# EAGLE design cubey_v3 (EAGLE 9.6.2)
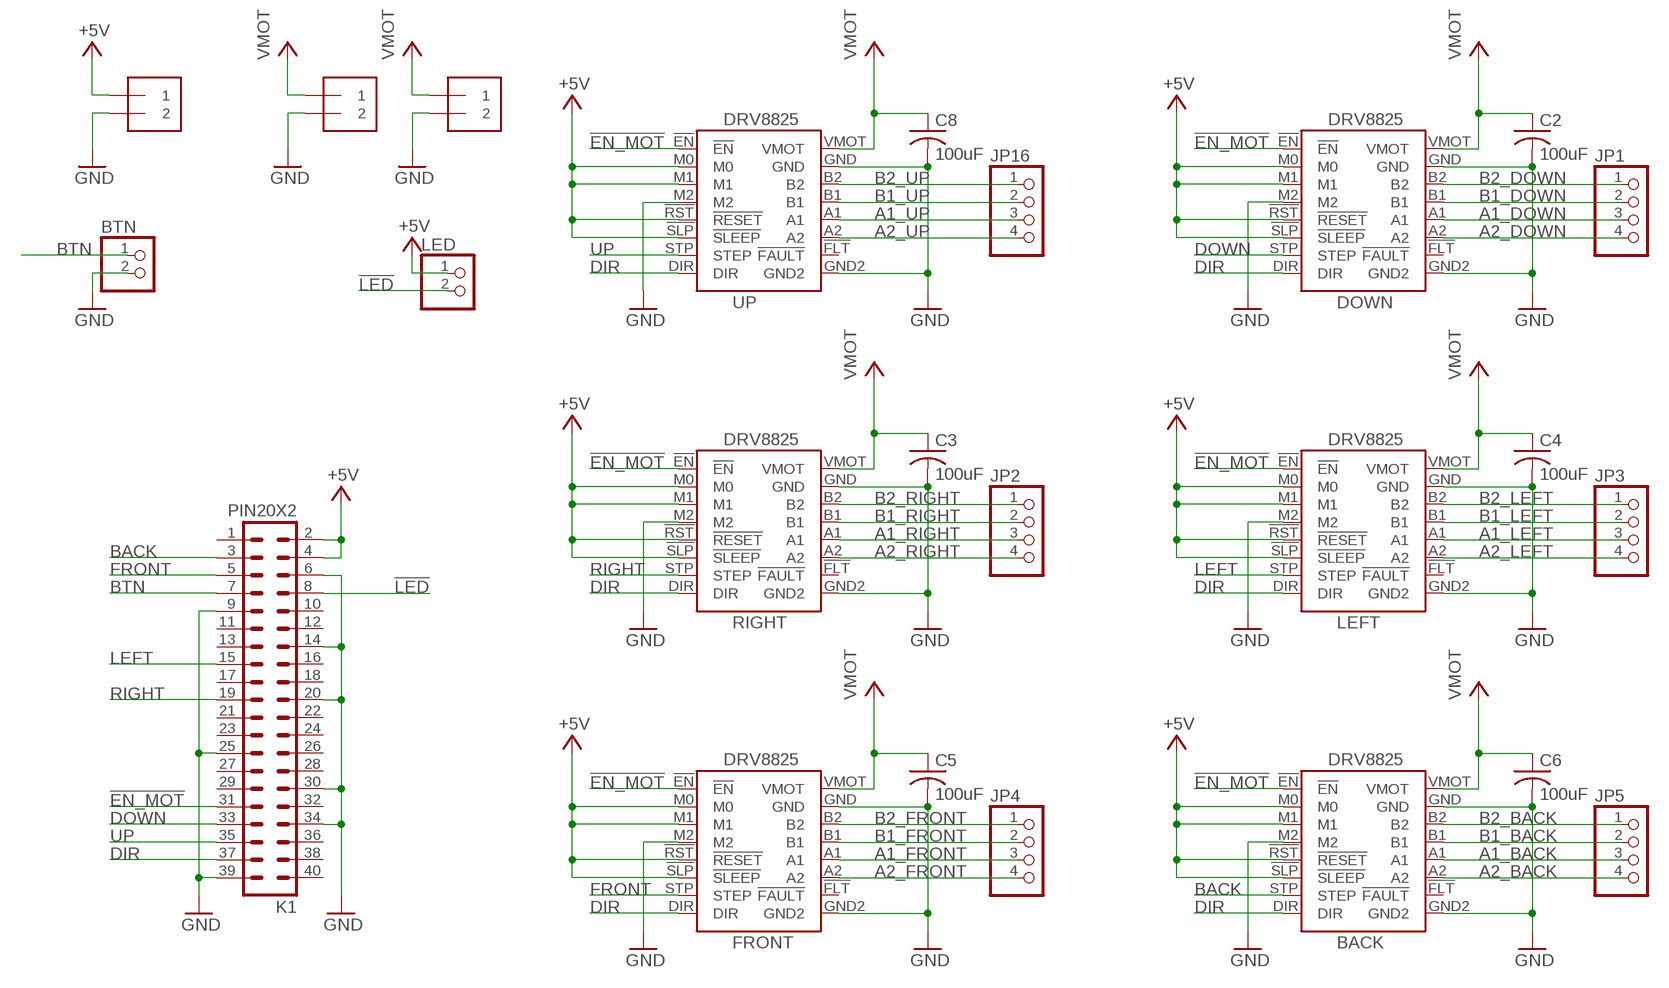
[diagram p0: schematic, sheet 1]

## Parts
5V_PWR  1X2-3.5MM  [1X2-3.5MM]
BACK  DRV_8825_SOCKET  [DRV_8825_DIP]
BTN  PINHD-1X2  [1X02]
C2  100uF  C-US025-025X050  [C025-025X050]
C3  100uF  C-US025-025X050  [C025-025X050]
C4  100uF  C-US025-025X050  [C025-025X050]
C5  100uF  C-US025-025X050  [C025-025X050]
C6  100uF  C-US025-025X050  [C025-025X050]
C8  100uF  C-US025-025X050  [C025-025X050]
DOWN  DRV_8825_SOCKET  [DRV_8825_DIP]
FRONT  DRV_8825_SOCKET  [DRV_8825_DIP]
JP1  PINHD-1X4  [1X04]
JP2  PINHD-1X4  [1X04]
JP3  PINHD-1X4  [1X04]
JP4  PINHD-1X4  [1X04]
JP5  PINHD-1X4  [1X04]
JP16  PINHD-1X4  [1X04]
K1  PIN20X2  [PIN_20X2]
LED  PINHD-1X2  [1X02]
LEFT  DRV_8825_SOCKET  [DRV_8825_DIP]
MOT_PWR  1X2-3.5MM  [1X2-3.5MM]
MOT_PWR1  1X2-3.5MM  [1X2-3.5MM]
RIGHT  DRV_8825_SOCKET  [DRV_8825_DIP]
UP  DRV_8825_SOCKET  [DRV_8825_DIP]

## Nets
!EN_MOT: BACK.!EN DOWN.!EN FRONT.!EN K1.31 LEFT.!EN RIGHT.!EN UP.!EN
!LED: K1.8 LED.2
+5V: 5V_PWR.1 BACK.!RST(!RESET) BACK.!SLP(!SLEEP) BACK.M0 BACK.M1 DOWN.!RST(!RESET) DOWN.!SLP(!SLEEP) DOWN.M0 DOWN.M1 FRONT.!RST(!RESET) FRONT.!SLP(!SLEEP) FRONT.M0 FRONT.M1 K1.2 K1.4 LED.1 LEFT.!RST(!RESET) LEFT.!SLP(!SLEEP) LEFT.M0 LEFT.M1 RIGHT.!RST(!RESET) RIGHT.!SLP(!SLEEP) RIGHT.M0 RIGHT.M1 UP.!RST(!RESET) UP.!SLP(!SLEEP) UP.M0 UP.M1
A1_BACK: BACK.A1 JP5.3
A1_DOWN: DOWN.A1 JP1.3
A1_FRONT: FRONT.A1 JP4.3
A1_LEFT: JP3.3 LEFT.A1
A1_RIGHT: JP2.3 RIGHT.A1
A1_UP: JP16.3 UP.A1
A2_BACK: BACK.A2 JP5.4
A2_DOWN: DOWN.A2 JP1.4
A2_FRONT: FRONT.A2 JP4.4
A2_LEFT: JP3.4 LEFT.A2
A2_RIGHT: JP2.4 RIGHT.A2
A2_UP: JP16.4 UP.A2
B1_BACK: BACK.B1 JP5.2
B1_DOWN: DOWN.B1 JP1.2
B1_FRONT: FRONT.B1 JP4.2
B1_LEFT: JP3.2 LEFT.B1
B1_RIGHT: JP2.2 RIGHT.B1
B1_UP: JP16.2 UP.B1
B2_BACK: BACK.B2 JP5.1
B2_DOWN: DOWN.B2 JP1.1
B2_FRONT: FRONT.B2 JP4.1
B2_LEFT: JP3.1 LEFT.B2
B2_RIGHT: JP2.1 RIGHT.B2
B2_UP: JP16.1 UP.B2
BACK: BACK.STP(STEP) K1.3
BTN: BTN.1 K1.7
DIR: BACK.DIR DOWN.DIR FRONT.DIR K1.37 LEFT.DIR RIGHT.DIR UP.DIR
DOWN: DOWN.STP(STEP) K1.33
FRONT: FRONT.STP(STEP) K1.5
GND: 5V_PWR.2 BACK.GND BACK.GND2 BACK.M2 BTN.2 C2.2 C3.2 C4.2 C5.2 C6.2 C8.2 DOWN.GND DOWN.GND2 DOWN.M2 FRONT.GND FRONT.GND2 FRONT.M2 K1.6 K1.9 K1.14 K1.20 K1.25 K1.30 K1.34 K1.39 LEFT.GND LEFT.GND2 LEFT.M2 MOT_PWR1.2 MOT_PWR.2 RIGHT.GND RIGHT.GND2 RIGHT.M2 UP.GND UP.GND2 UP.M2
LEFT: K1.15 LEFT.STP(STEP)
RIGHT: K1.19 RIGHT.STP(STEP)
UP: K1.35 UP.STP(STEP)
VCC: BACK.VMOT C2.1 C3.1 C4.1 C5.1 C6.1 C8.1 DOWN.VMOT FRONT.VMOT LEFT.VMOT MOT_PWR1.1 MOT_PWR.1 RIGHT.VMOT UP.VMOT ; supply symbol labelled VMOT
Unconnected: BACK.!FLT(!FAULT) DOWN.!FLT(!FAULT) FRONT.!FLT(!FAULT) K1.1 K1.10 K1.11 K1.12 K1.13 K1.16 K1.17 K1.18 K1.21 K1.22 K1.23 K1.24 K1.26 K1.27 K1.28 K1.29 K1.32 K1.36 K1.38 K1.40 LEFT.!FLT(!FAULT) RIGHT.!FLT(!FAULT) UP.!FLT(!FAULT)

## Library data of the parts
5V_PWR MOT_PWR MOT_PWR1 = adafruit:1X2: 3.5mm Terminal block http://www.ladyada.net/library/pcb/eaglelibrary.html
BACK DOWN FRONT LEFT RIGHT UP = cubey:DRV_8825_SOCKET: DIP socket for DRV_8825 module from Pololu
BTN LED = pinhead:PINHD-1X2: PIN HEADER
C2-C6 C8 = rcl:C-US: CAPACITOR, American symbol; SPICEPREFIX: C
JP1-JP5 JP16 = pinhead:PINHD-1X4: PIN HEADER
K1 = FLYFISH:PIN20X2

## Net classes
0 default: width 0.406 mm, clearance 0.203 mm

## Board
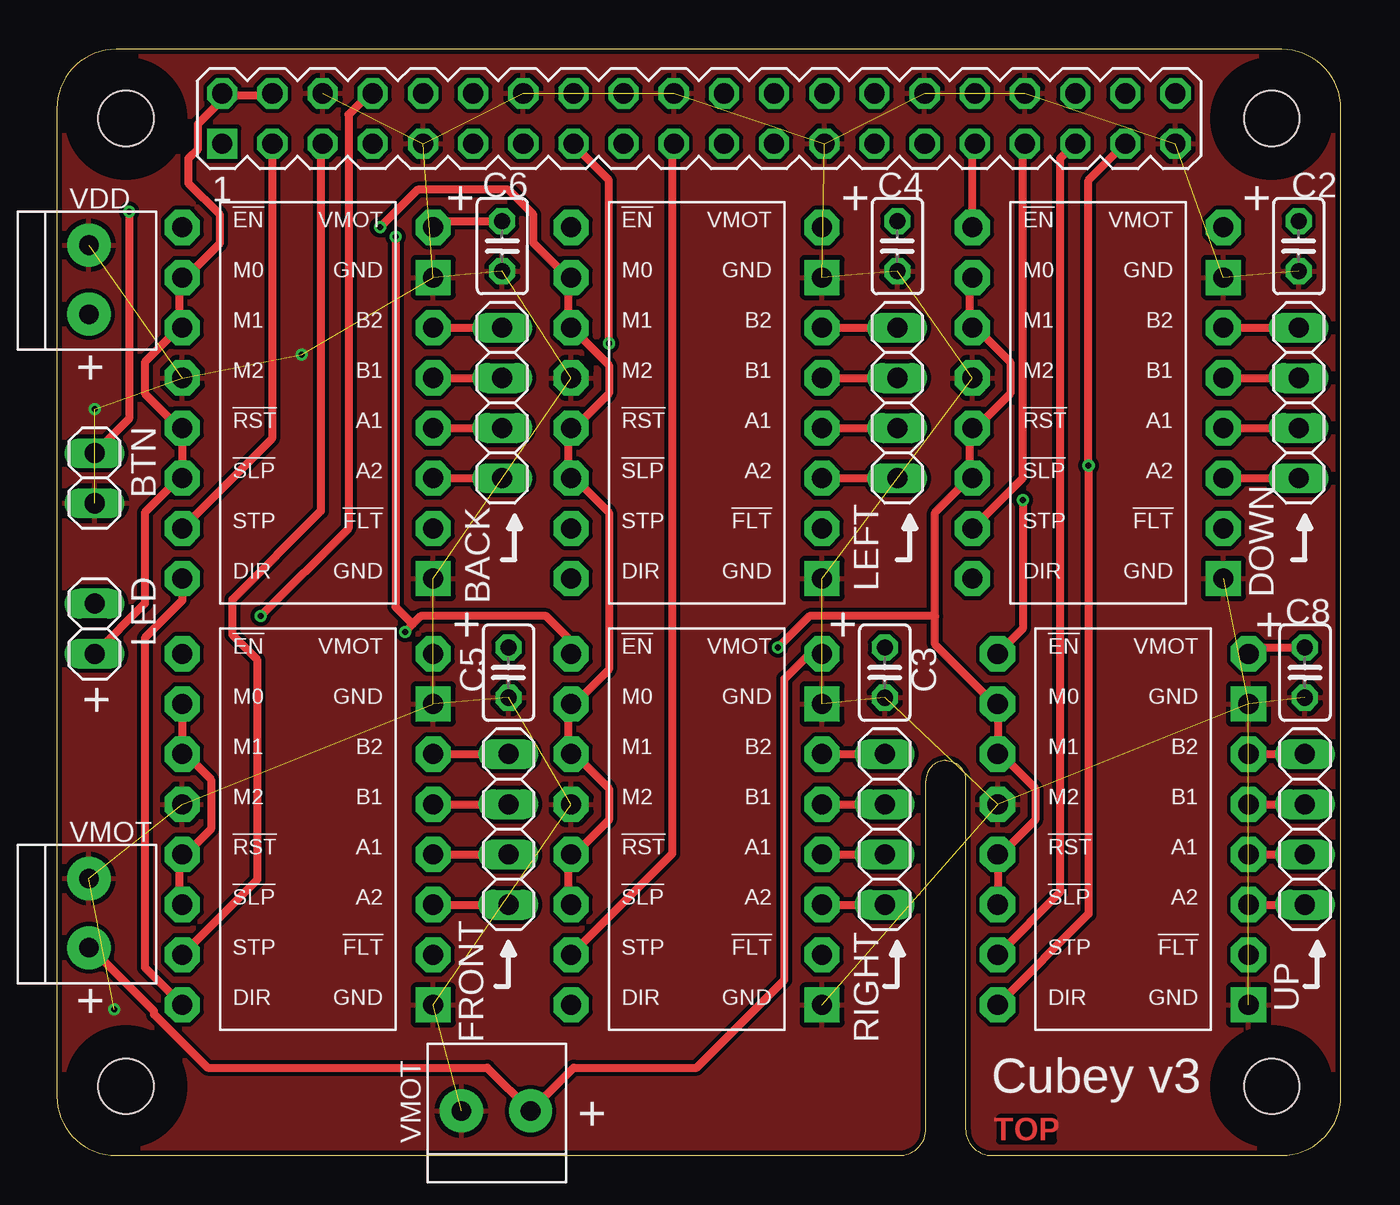
[diagram p1: board, top side]
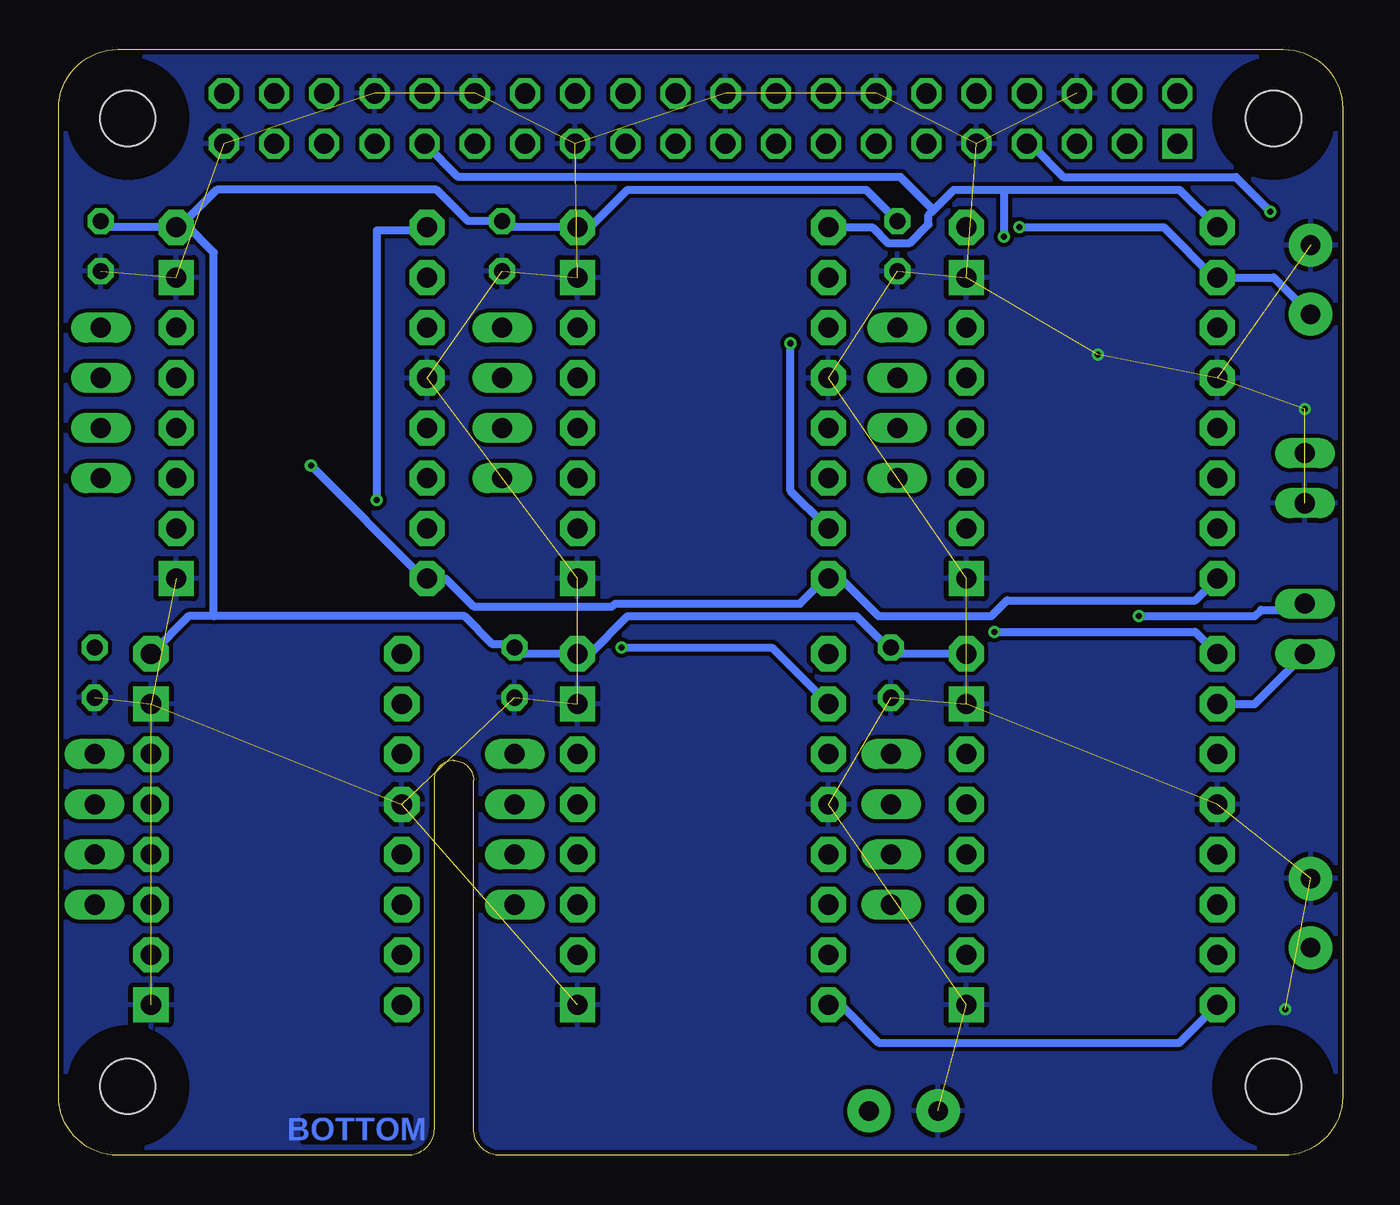
[diagram p2: board, bottom side, seen from below]

Size 65 x 56 mm. Coordinates in mm from the lower left corner, seen from the top.
Outline: 0,3 arc90 3,0 42.63,0 arc90 44,1.37 44,19 arc-90 45,20 arc-90 46,19 46,1.35 arc90 47.35,0 62,0 arc90 65,3 65,53 arc90 62,56 3,56 arc90 0,53 0,3
Copper layers (1*16): Top 0.035mm / dielectric 1.5mm / Bottom 0.035mm
Design rules "ITEADstudio_DRC": minimum track width 6mil, minimum drill 12mil, track to track 6mil, track to pad 6mil, pad to pad 6mil, via to via 6mil, smd to smd 0mil, copper to edge 10mil, drill to drill 10mil, minimum pad ring 10mil, minimum via ring 6mil, stop-mask expansion 2mil, vias tented up to drill 100mil, thermal gap 10mil
Holes 2.8 mm at 3.5,3.5 3.5,52.5 61.5,52.5 61.5,3.5
tRestrict: area 1.9,51 to 5,54; area 60,51 to 63,54; area 60,1.9 to 63,5; area 1.9,1.9 to 5,5
bRestrict: area 1.9,1.9 to 5,5; area 1.9,51 to 5,54; area 60,1.9 to 63,5; area 60,51 to 63,54

### Footprints (pad centres in the part's own frame; a part is rotated, then mirrored left to right if it is on the bottom)
1X2-3.5MM = drill 1 pad 2.184: 1 1.8,0; 2 -1.7,0
DRV_8825_DIP = drill 1.016 pad 1.778 octagon: !EN -7.62,10.16; !FLT 5.08,-5.08; !RST -7.62,0; !SLP -7.62,-2.54; A1 5.08,0; A2 5.08,-2.54; B1 5.08,2.54; B2 5.08,5.08; DIR -7.62,-7.62; M0 -7.62,7.62; M1 -7.62,5.08; M2 -7.62,2.54; STP -7.62,-5.08; VMOT 5.08,10.16 | drill 1.016 pad 1.778 square: GND 5.08,7.62; GND2 5.08,-7.62
1X02 = drill 1.016 long: 1 -1.27,0; 2 1.27,0
C025-025X050 = drill 0.813 octagon: 1 -1.27,0; 2 1.27,0
1X04 = drill 1.016 long: 1 -3.81,0; 2 -1.27,0; 3 1.27,0; 4 3.81,0
PIN_20X2 = drill 1.016 square: 1 -24.13,-1.27 | drill 1.016 octagon: 2 -24.13,1.27; 3 -21.59,-1.27; 4 -21.59,1.27; 5 -19.05,-1.27; 6 -19.05,1.27; 7 -16.51,-1.27; 8 -16.51,1.27; 9 -13.97,-1.27; 10 -13.97,1.27; 11 -11.43,-1.27; 12 -11.43,1.27; 13 -8.89,-1.27; 14 -8.89,1.27; 15 -6.35,-1.27; 16 -6.35,1.27; 17 -3.81,-1.27; 18 -3.81,1.27; 19 -1.27,-1.27; 20 -1.27,1.27; 21 1.27,-1.27; 22 1.27,1.27; 23 3.81,-1.27; 24 3.81,1.27; 25 6.35,-1.27; 26 6.35,1.27; 27 8.89,-1.27; 28 8.89,1.27; 29 11.43,-1.27; 30 11.43,1.27; 31 13.97,-1.27; 32 13.97,1.27; 33 16.51,-1.27; 34 16.51,1.27; 35 19.05,-1.27; 36 19.05,1.27; 37 21.59,-1.27; 38 21.59,1.27; 39 24.13,-1.27; 40 24.13,1.27

### Placement (x,y rotation side)
5V_PWR  1.62,44.39 270 top
BACK  13.97,36.83 0 top
BTN  1.91,34.29 270 top
C2  62.87,46.04 270 top
C3  41.91,24.45 270 top
C4  42.55,46.04 270 top
C5  22.86,24.45 270 top
C6  22.54,46.04 270 top
C8  63.18,24.45 270 top
DOWN  53.98,36.83 0 top
FRONT  13.97,15.24 0 top
JP1  62.87,38.1 270 top
JP2  41.91,16.51 270 top
JP3  42.55,38.1 270 top
JP4  22.86,16.51 270 top
JP5  22.54,38.1 270 top
JP16  63.18,16.51 270 top
K1  32.5,52.5 0 top
LED  1.91,26.67 90 top
LEFT  33.66,36.83 0 top
MOT_PWR  22.18,2.25 0 top
MOT_PWR1  1.62,12.32 270 top
RIGHT  33.66,15.24 0 top
UP  55.24,15.24 0 top

### Tracks (layer width: path | path; a pad name or v marks a point on that pad's centre or on a via)
!EN_MOT  (via drill 0.3)
  Top 0.406: DOWN.!EN 46.35,51.12 K1.31 | UP.!EN 48.9,26.67 v48.9,33.18 | 18.02,26.91 18.41,27.3 24.77,27.3 25.88,26.19 25.88,25.56 RIGHT.!EN | 18.02,26.91 v17.62,26.51 | 18.02,26.91 17.14,27.78 v17.14,46.51
  Bottom 0.406: v48.9,33.18 48.9,46.83 46.51,46.83 DOWN.!EN | FRONT.!EN 7.46,26.51 v17.62,26.51 | BACK.!EN 8.26,48.9 17.14,48.9 | 17.14,48.9 19.68,48.9 20.72,47.86 | 20.72,47.86 20.95,47.62 20.95,47.15 21.9,46.2 23.02,46.2 23.81,46.99 LEFT.!EN | 17.14,48.9 v17.14,46.51 | 20.72,47.86 22.38,49.53 44.77,49.53 46.35,51.12 K1.31
!LED  (via drill 0.3)
  Top 0.406: v10.32,27.3 14.76,31.75 14.76,52.7 15.88,53.82 K1.8
  Bottom 0.406: LED.2 2.22,27.62 4.13,27.62 4.45,27.3 v10.32,27.3
+5V  (via drill 0.3)
  Top 0.406: FRONT.!SLP 6.19,12.86 6.19,15.08 FRONT.!RST 6.51,15.24 7.8,16.53 7.8,19.03 6.51,20.32 FRONT.M1 FRONT.M0 | K1.4 10.79,53.66 8.41,53.66 K1.2 8.41,53.5 7.14,52.23 7.14,50.96 6.67,50.48 6.67,49.21 8.26,47.62 8.26,46.2 6.51,44.45 BACK.M0 6.19,44.29 6.19,42.07 BACK.M1 6.19,41.91 4.45,40.16 4.45,38.58 6.19,36.83 BACK.!RST BACK.!SLP 6.19,34.29 4.45,32.54 4.45,27.94 LED.1 | RIGHT.!SLP 25.88,12.86 25.88,15.08 RIGHT.!RST 26.19,15.24 27.94,16.99 27.94,18.57 26.19,20.32 RIGHT.M1 25.88,20.48 25.88,22.7 RIGHT.M0 26.19,22.86 27.94,24.61 27.94,32.54 26.19,34.29 LEFT.!SLP 25.88,34.45 25.88,36.67 LEFT.!RST 26.19,36.83 27.94,38.58 27.94,40.01 26.19,41.75 26.19,41.91 LEFT.M1 25.88,42.07 25.88,44.29 LEFT.M0 25.88,44.45 24.13,46.2 24.13,47.62 22.86,48.9 18.26,48.9 v16.35,46.99 | DOWN.M0 46.2,44.29 46.2,42.07 DOWN.M1 46.51,41.91 48.26,40.16 48.26,38.58 46.51,36.83 DOWN.!RST 46.2,36.67 46.2,34.45 DOWN.!SLP 46.2,34.29 44.45,32.54 44.45,27.3 | UP.!SLP UP.!RST 47.78,15.24 49.53,16.99 49.53,18.57 47.78,20.32 UP.M1 UP.M0 47.47,22.86 44.45,25.88 44.45,27.3 | v36.51,25.72 38.1,27.3 44.45,27.3
  Bottom 0.406: LED.1 4.45,22.86 FRONT.M0 | 5V_PWR.1 1.75,42.7 3.49,44.45 BACK.M0 6.51,44.45 9.05,46.99 v16.35,46.99 | RIGHT.M0 28.89,25.72 v36.51,25.72
A1_BACK
  Top 0.406: BACK.A1 JP5.3
A1_DOWN
  Top 0.406: DOWN.A1 JP1.3
A1_FRONT
  Top 0.406: FRONT.A1 JP4.3
A1_LEFT
  Top 0.406: LEFT.A1 JP3.3
A1_RIGHT
  Top 0.406: RIGHT.A1 JP2.3
A1_UP
  Top 0.406: UP.A1 JP16.3
A2_BACK
  Top 0.406: BACK.A2 JP5.4
A2_DOWN
  Top 0.406: DOWN.A2 JP1.4
A2_FRONT
  Top 0.406: FRONT.A2 JP4.4
A2_LEFT
  Top 0.406: LEFT.A2 JP3.4
A2_RIGHT
  Top 0.406: RIGHT.A2 JP2.4
A2_UP
  Top 0.406: UP.A2 JP16.4
B1_BACK
  Top 0.406: BACK.B1 JP5.2
B1_DOWN
  Top 0.406: DOWN.B1 JP1.2
B1_FRONT
  Top 0.406: FRONT.B1 JP4.2
B1_LEFT
  Top 0.406: LEFT.B1 JP3.2
B1_RIGHT
  Top 0.406: RIGHT.B1 JP2.2
B1_UP
  Top 0.406: UP.B1 JP16.2
B2_BACK
  Top 0.406: BACK.B2 JP5.1
B2_DOWN
  Top 0.406: DOWN.B2 JP1.1
B2_FRONT
  Top 0.406: FRONT.B2 JP4.1
B2_LEFT
  Top 0.406: LEFT.B2 JP3.1
B2_RIGHT
  Top 0.406: RIGHT.B2 JP2.1
B2_UP
  Top 0.406: UP.B2 JP16.1
BACK
  Top 0.406: BACK.STP 10.89,36.29 10.89,51.02 10.79,51.12 K1.3
BTN  (via drill 0.3)
  Top 0.406: BTN.1 3.65,37.31 v3.65,47.78
  Bottom 0.406: v3.65,47.78 5.4,49.53 14.13,49.53 15.72,51.12 15.88,51.12 K1.7
DIR  (via drill 0.3)
  Top 0.406: FRONT.DIR 4.45,9.53 4.45,26.19 6.35,28.1 BACK.DIR | K1.37 53.98,51.12 52.23,49.37 v52.23,34.92 52.23,12.22 UP.DIR
  Bottom 0.406: FRONT.DIR 8.26,5.71 23.5,5.71 25.4,7.62 RIGHT.DIR | BACK.DIR 7.46,28.1 16.99,28.1 17.78,27.3 23.5,27.3 25.4,29.21 LEFT.DIR 26.19,29.21 27.46,27.94 36.83,27.94 36.97,27.8 43.99,27.8 45.4,29.21 DOWN.DIR 46.51,29.21 v52.23,34.92
DOWN
  Top 0.406: DOWN.STP 48.9,34.29 48.9,51.12 K1.33
FRONT
  Top 0.406: FRONT.STP 10.16,13.97 10.16,25.08 8.89,26.35 8.89,28.15 13.36,32.62 13.36,51.09 13.34,51.12 K1.5
GND  (via drill 0.3)  (38 unrouted)
  other vias: 12.4,40.54 1.91,37.78 2.9,7.4
  pour Bottom: 0,3 arc90 3,0 62,0 arc90 65,3 65,53 arc90 62,56 3,56 arc90 0,53
  pour Top: 0,3 arc90 3,0 62,0 arc90 65,3 65,53 arc90 62,56 3,56 arc90 0,53
LEFT  (via drill 0.3)
  Top 0.406: v27.94,41.12 27.94,49.37 26.19,51.12 K1.15
  Bottom 0.406: v27.94,41.12 27.94,33.64 26.21,31.91 26.19,31.91 LEFT.STP
RIGHT
  Top 0.406: RIGHT.STP 31.15,15.28 31.15,51.08 31.11,51.12 K1.19
UP
  Top 0.406: UP.STP 50.8,13.34 50.8,50.48 51.44,51.12 K1.35
VCC
  Top 0.406: C6.1 19.05,47.31 BACK.VMOT | C8.1 60.33,25.72 UP.VMOT | RIGHT.VMOT 38.1,25.4 36.83,24.13 36.83,8.89 32.38,4.45 26.16,4.45 MOT_PWR.1 21.79,4.45 7.62,4.45 4.92,7.14 4.92,7.3 1.75,10.48 MOT_PWR1.1
  Bottom 0.406: C2.1 62.55,46.99 DOWN.VMOT | C6.1 24.13,48.9 36.2,48.9 38.1,46.99 LEFT.VMOT 42.23,46.99 C4.1 44.28,47.31 45.87,48.9 56.99,48.9 58.9,46.99 DOWN.VMOT | FRONT.VMOT 22.54,25.4 C5.1 23.02,25.72 24.61,27.3 36.2,27.3 38.1,25.4 RIGHT.VMOT 41.59,25.4 C3.1 41.91,25.88 43.02,25.88 44.45,27.3 57.15,27.3 | UP.VMOT 58.42,27.3 57.15,27.3 | 57.15,27.3 57.15,45.72 58.58,47.15 DOWN.VMOT

### Text on the board
Top: TOP
Bottom: BOTTOM
tPlace: + | + | + | + | + | + | + | + | + | +
tNames: VDD | VMOT | Cubey v3 | VMOT